# EAGLE schematic MidiWah (EAGLE 6.4)
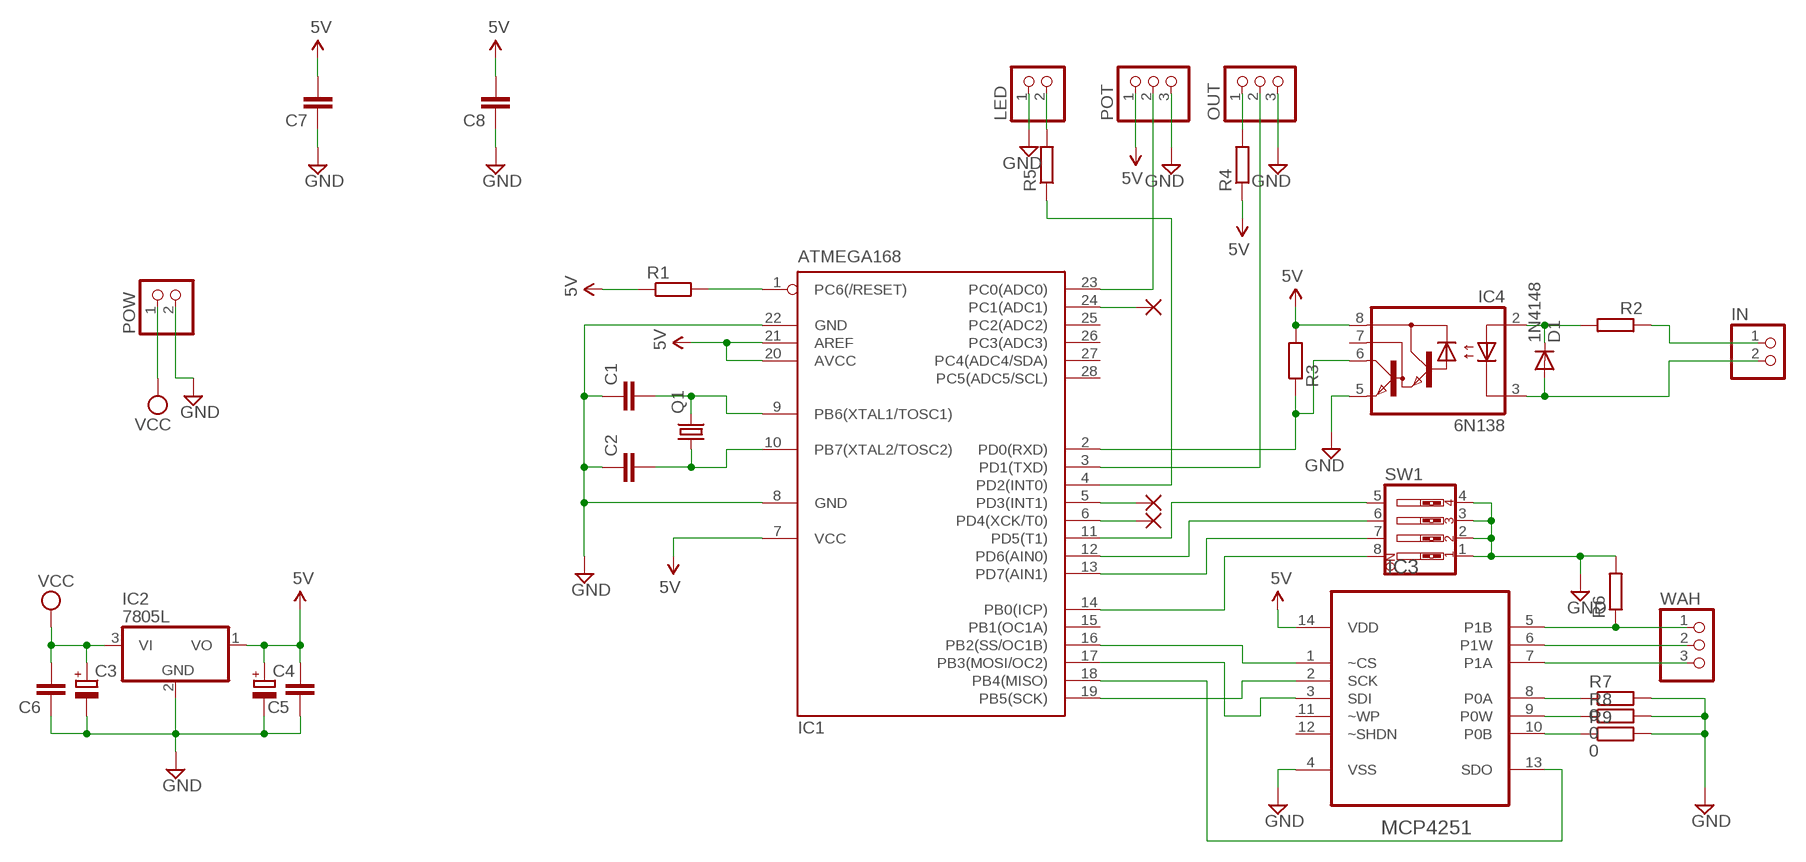
[diagram p0: schematic, sheet 1]

## Parts
C1  C-EU025-024X044  [C025-024X044]
C2  C-EU025-024X044  [C025-024X044]
C3  CPOL-EUE2.5-5  [E2,5-5]
C4  CPOL-EUE2.5-5  [E2,5-5]
C5  C-EU025-024X044  [C025-024X044]
C6  C-EU025-024X044  [C025-024X044]
C7  C-EU025-024X044  [C025-024X044]
C8  C-EU025-024X044  [C025-024X044]
D1  1N4148  1N4148DO35-7  [DO35-7]
IC1  ATMEGA168  MEGA8-P  [DIL28-3]
IC2  7805L  [TO92]
IC3  MCP4251  MCP4251-104E/P  [DIP254P762X533-14]
IC4  6N138  [DIL08]
IN  PINHD-1X2  [1X02]
LED  PINHD-1X2  [1X02]
OUT  PINHD-1X3  [1X03]
PAD1  WIREPAD1,6/0,8  [1,6/0,8]
PAD2  WIREPAD1,6/0,8  [1,6/0,8]
PAD3  WIREPAD1,6/0,8  [1,6/0,8]
POT  PINHD-1X3  [1X03]
POW  PINHD-1X2  [1X02]
Q1  CRYSTALHC49S  [HC49/S]
R1  R-EU_0204/7  [0204/7]
R2  R-EU_0204/7  [0204/7]
R3  R-EU_0204/7  [0204/7]
R4  R-EU_0204/7  [0204/7]
R5  R-EU_0204/7  [0204/7]
R6  R-EU_0204/2V  [0204V]
R7  0  R-EU_M0805  [M0805]
R8  0  R-EU_M0805  [M0805]
R9  0  R-EU_M0805  [M0805]
SW1  SW_DIP-4  [EDG-04]
WAH  PINHD-1X3  [1X03]

## Nets
5V: C4.+ C5.2 C7.2 C8.2 IC1.7(VCC) IC1.20(AVCC) IC1.21(AREF) IC2.1(VO) IC3.14(VDD) IC4.8(VCC) POT.1 R1.1 R3.2 R4.1
GND: C1.1 C2.1 C3.- C4.- C5.1 C6.1 C7.1 C8.1 IC1.8(GND) IC1.22(GND) IC2.2(GND) IC3.4(VSS) IC4.5(GND) LED.1 OUT.3 POT.3 POW.2 R6.2 R7.2 R8.2 R9.2 SW1.1 SW1.2 SW1.3 SW1.4
N$1: IC1.1(PC6(/RESET)) R1.2
N$2: IC1.16(PB2(SS/OC1B)) IC3.1(~CS)
N$3: C1.2 IC1.9(PB6(XTAL1/TOSC1)) Q1.2
N$4: C2.2 IC1.10(PB7(XTAL2/TOSC2)) Q1.1
N$5: IC1.19(PB5(SCK)) IC3.2(SCK)
N$6: IC1.18(PB4(MISO)) IC3.13(SDO)
N$7: IC1.17(PB3(MOSI/OC2)) IC3.3(SDI)
N$8: D1.A IC4.3(C) IN.2
N$9: D1.C IC4.2(A) R2.2
N$10: IN.1 R2.1
N$11: IC1.2(PD0(RXD)) IC4.6(VO) R3.1
N$12: IC1.14(PB0(ICP)) SW1.8
N$13: IC1.13(PD7(AIN1)) SW1.7
N$14: IC1.12(PD6(AIN0)) SW1.6
N$15: IC1.11(PD5(T1)) SW1.5
N$16: IC1.23(PC0(ADC0)) POT.2
N$17: IC3.6(P1W) WAH.2
N$18: IC3.8(P0A) R7.1
N$19: IC3.7(P1A) WAH.3
N$20: IC1.3(PD1(TXD)) OUT.2
N$21: OUT.1 R4.2
N$22: LED.2 R5.2
N$23: IC1.4(PD2(INT0)) R5.1
N$24: IC3.5(P1B) R6.1 WAH.1
N$25: IC3.9(P0W) R8.1
N$26: IC3.10(P0B) R9.1
N$27: IC1.5(PD3(INT1)) PAD2.1(P)
N$28: IC1.6(PD4(XCK/T0)) PAD3.1(P)
N$29: IC1.24(PC1(ADC1)) PAD1.1(P)
VCC: C3.+ C6.2 IC2.3(VI) POW.1
Unconnected: IC1.15(PB1(OC1A)) IC1.25(PC2(ADC2)) IC1.26(PC3(ADC3)) IC1.27(PC4(ADC4/SDA)) IC1.28(PC5(ADC5/SCL)) IC3.11(~WP) IC3.12(~SHDN) IC4.7(VB)

## Library data of the parts
C1 C2 C5-C8 = rcl:C-EU: CAPACITOR, European symbol
C3 C4 = rcl:CPOL-EU: POLARIZED CAPACITOR, European symbol
D1 = diode:1N4148: DIODE high speed (Philips)
IC1 = atmel:MEGA8-P: MICROCONTROLLER 8 Kbytes FLASH, 1 kbytes SRAM, 512 bytes EEPROM, USART, 4-channel 10 bit ADC, 2-channel 8 bit ADC Pin compatible with Atmega48, ATMega88, ATMega168 Source: avr.lbr; OC_FARNELL: unknown; OC_NEWARK: unknown
IC2 = linear:78*: Positive VOLTAGE REGULATOR Source: http://cache.national.com/ds/LM/LM78L05.pdf http://www.fairchildsemi.com/ds/LM/LM7805.pdf
IC3 = Microchip_By_element14_Batch_1:MCP4251-104E/P: Digital POT; MPN: MCP4251-104E/P; OC_FARNELL: 1840692; OC_NEWARK: 27M0150; PACKAGE: DIP-14; SUPPLIER: Microchip
IC4 = optocoupler:6N138: MOTOROLA OPTO COUPLER; MF: VISHAY/TELEFUNKEN; MPN: 6N138; OC_FARNELL: 9860150; OC_NEWARK: 35K5294
IN LED POW = pinhead:PINHD-1X2: PIN HEADER
OUT POT WAH = pinhead:PINHD-1X3: PIN HEADER
PAD1-PAD3 = wirepad:WIREPAD: Wire PAD connect wire on PCB
Q1 = crystal:CRYSTAL: CRYSTAL; OC_FARNELL: 1667008; OC_NEWARK: unknown
R1-R9 = rcl:R-EU_: RESISTOR, European symbol
SW1 = special:SW_DIP-4: DIP SWITCH